# EAGLE schematic MultiDrop (EAGLE 7.6.0)
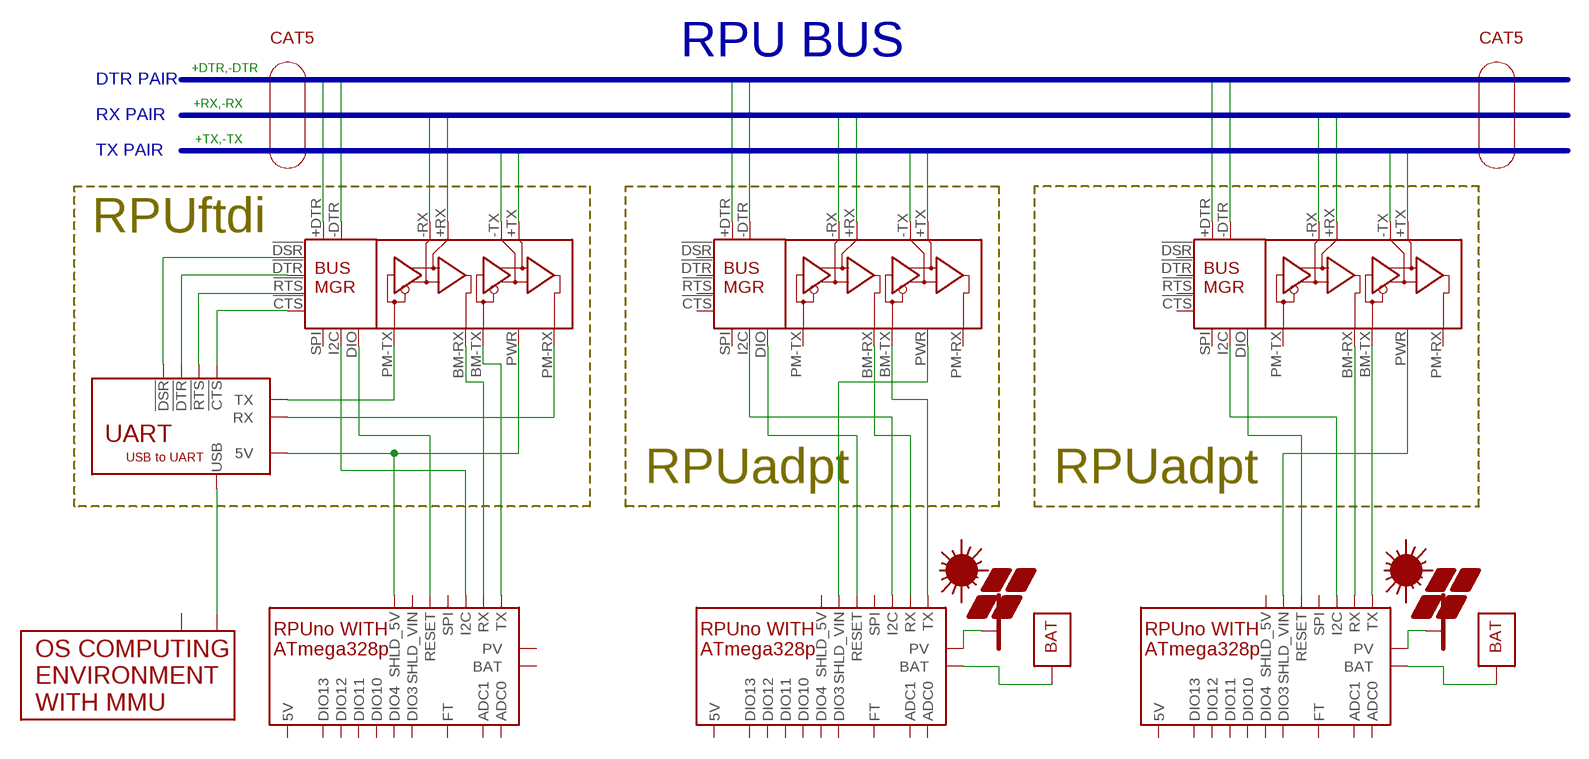
[diagram p0: schematic, sheet 1]

## Parts
BM1  RPUNO  [NA-20]
BM2  RPUNO  [NA-20]
BM3  RPUNO  [NA-20]
PM2  TRUSTWORTHY  [NA-20]
PV2  PV  [NA-20]
PV4  PV  [NA-20]
U$1  BUS_MGR  [NA-10_WITH_RPU_NAMES]
U$2  BUS_MGR  [NA-10_WITH_RPU_NAMES]
U$5  BUS_MGR  [NA-10_WITH_RPU_NAMES]
U$7  BAT  [NA-20]
U$9  BAT  [NA-20]
UART1  UART  [NA-20]

## Nets
+DTR: U$1.+DTR
+DTR1: U$2.+DTR
+DTR3: U$5.+DTR
+RX: U$1.+RX
+RX1: U$2.+RX
+RX3: U$5.+RX
+TX: U$1.+TX
+TX1: U$2.+TX
+TX3: U$5.+TX
-DTR: U$1.-DTR
-DTR1: U$2.-DTR
-DTR3: U$5.-DTR
-RX: U$1.-RX
-RX1: U$2.-RX
-RX3: U$5.-RX
-TX: U$1.-TX
-TX1: U$2.-TX
-TX3: U$5.-TX
N$1: BM2.1(TX) U$1.BM-TX(BM_TX)
N$2: BM2.2(RX) U$1.BM-RX(BM_RX)
N$3: PM2.2(TX) UART1.7(USB)
N$4: U$1.!CTS UART1.1(!CTS)
N$5: U$1.!RTS UART1.4(!RTS)
N$6: U$1.!DTR UART1.3(!DTR)
N$7: U$1.!DSR UART1.2(!DSR)
N$8: U$1.PM-RX(PM_RX) UART1.5(RX)
N$9: U$1.PM-TX(PM_TX) UART1.6(TX)
N$10: BM1.1(TX) U$2.BM-TX(BM_TX)
N$11: BM1.2(RX) U$2.BM-RX(BM_RX)
N$14: BM3.1(TX) U$5.BM-TX(BM_TX)
N$17: BM1.9(BAT) U$9.1(BAT_PWR)
N$21: BM3.2(RX) U$5.BM-RX(BM_RX)
N$29: BM2.6(SHLD_5V) U$1.PWR UART1.8(5V)
N$30: BM2.5(RESET) U$1.DIO
N$31: BM3.9(BAT) U$7.1(BAT_PWR)
N$32: BM3.3(I2C) U$5.I2C
N$33: BM2.3(I2C) U$1.I2C
N$34: BM3.8(PV) PV4.1(PV_PWR)
N$36: BM1.8(PV) PV2.1(PV_PWR)
N$41: BM3.7(SHLD_VIN) U$5.PWR
N$43: BM3.5(RESET) U$5.DIO
N$44: BM1.5(RESET) U$2.DIO
N$45: BM1.7(SHLD_VIN) U$2.PWR
N$48: BM1.3(I2C) U$2.I2C
Unconnected: BM1.4(SPI) BM1.6(SHLD_5V) BM1.10(ADC0) BM1.11(ADC1) BM1.12(FT) BM1.13(DIO3) BM1.14(DIO4) BM1.15(DIO10) BM1.16(DIO11) BM1.17(DIO12) BM1.18(DIO13) BM1.19(5V) BM2.4(SPI) BM2.7(SHLD_VIN) BM2.8(PV) BM2.9(BAT) BM2.10(ADC0) BM2.11(ADC1) BM2.12(FT) BM2.13(DIO3) BM2.14(DIO4) BM2.15(DIO10) BM2.16(DIO11) BM2.17(DIO12) BM2.18(DIO13) BM2.19(5V) BM3.4(SPI) BM3.6(SHLD_5V) BM3.10(ADC0) BM3.11(ADC1) BM3.12(FT) BM3.13(DIO3) BM3.14(DIO4) BM3.15(DIO10) BM3.16(DIO11) BM3.17(DIO12) BM3.18(DIO13) BM3.19(5V) PM2.1(RX) U$1.SPI U$2.!CTS U$2.!DSR U$2.!DTR U$2.!RTS U$2.PM-RX(PM_RX) U$2.PM-TX(PM_TX) U$2.SPI U$5.!CTS U$5.!DSR U$5.!DTR U$5.!RTS U$5.PM-RX(PM_RX) U$5.PM-TX(PM_TX) U$5.SPI

## Buses
+DTR,-DTR
+RX,-RX
+TX,-TX

## Notes on the sheet
- CAT5 | CAT5
- RPU BUS
- DTR PAIR
- RX PAIR
- TX PAIR
- RPUftdi
- RPUadpt | RPUadpt

## Library data of the parts
BM1-BM3 = Documentation:RPUNO
PM2 = Documentation:TRUSTWORTHY: Protected Mode
PV2 PV4 = Documentation:PV
U$1 U$2 U$5 = Documentation:BUS_MGR: RPU BUS MANAGER
U$7 U$9 = Documentation:BAT
UART1 = Documentation:UART: UART e.g. FTDI FT231X